# Altium schematic sheet Sheet3.SchDoc
size A
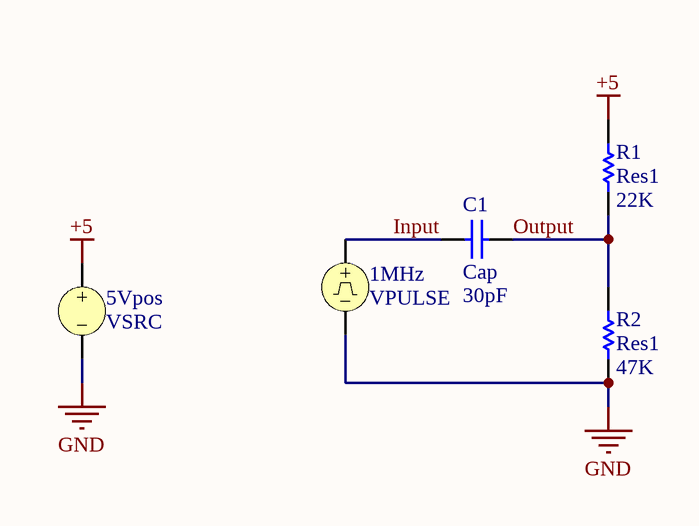
[diagram p0: Sheet3.SchDoc]

## Parts
1MHz  VPULSE
5Vpos  VSRC
C1  Cap  value 30pF  [RAD-0.3]
R1  Res1  value 22K  [AXIAL-0.3]
R2  Res1  value 47K  [AXIAL-0.3]

## Nets
+5: 5Vpos.1 R1.2
GND: 1MHz.2 5Vpos.2 R2.1
Input: 1MHz.1 C1.1
Output: C1.2 R1.1 R2.2

## Library data of the parts
1MHz = VPULSE: Pulse Voltage Source; Note: PCB Footprint - Not required; Published: 8-Jun-2000; LatestRevisionDate: 15-Nov-2004; LatestRevisionNote: Corrected Netlist.; PackageReference: Not Applicable; Publisher: Altium Limited
5Vpos = VSRC: Voltage Source; Note: PCB Footprint - Not required; Value: +5; Published: 8-Jun-2000; LatestRevisionDate: 17-Jul-2002; LatestRevisionNote: Re-released for DXP Platform.; PackageReference: Not Applicable; Publisher: Altium Limited
C1 = Cap: Capacitor; Manufacturer: Generic Components; Class: Passive; Published: 08/06/2000; Publisher: Altium Hobart Technology Centre; SubClass: Capacitor
R1 R2 = Res1: Resistor; Manufacturer: Generic Components; Class: Passive; Published: 08/06/2000; Publisher: Altium Hobart Technology Centre; SubClass: Resistor